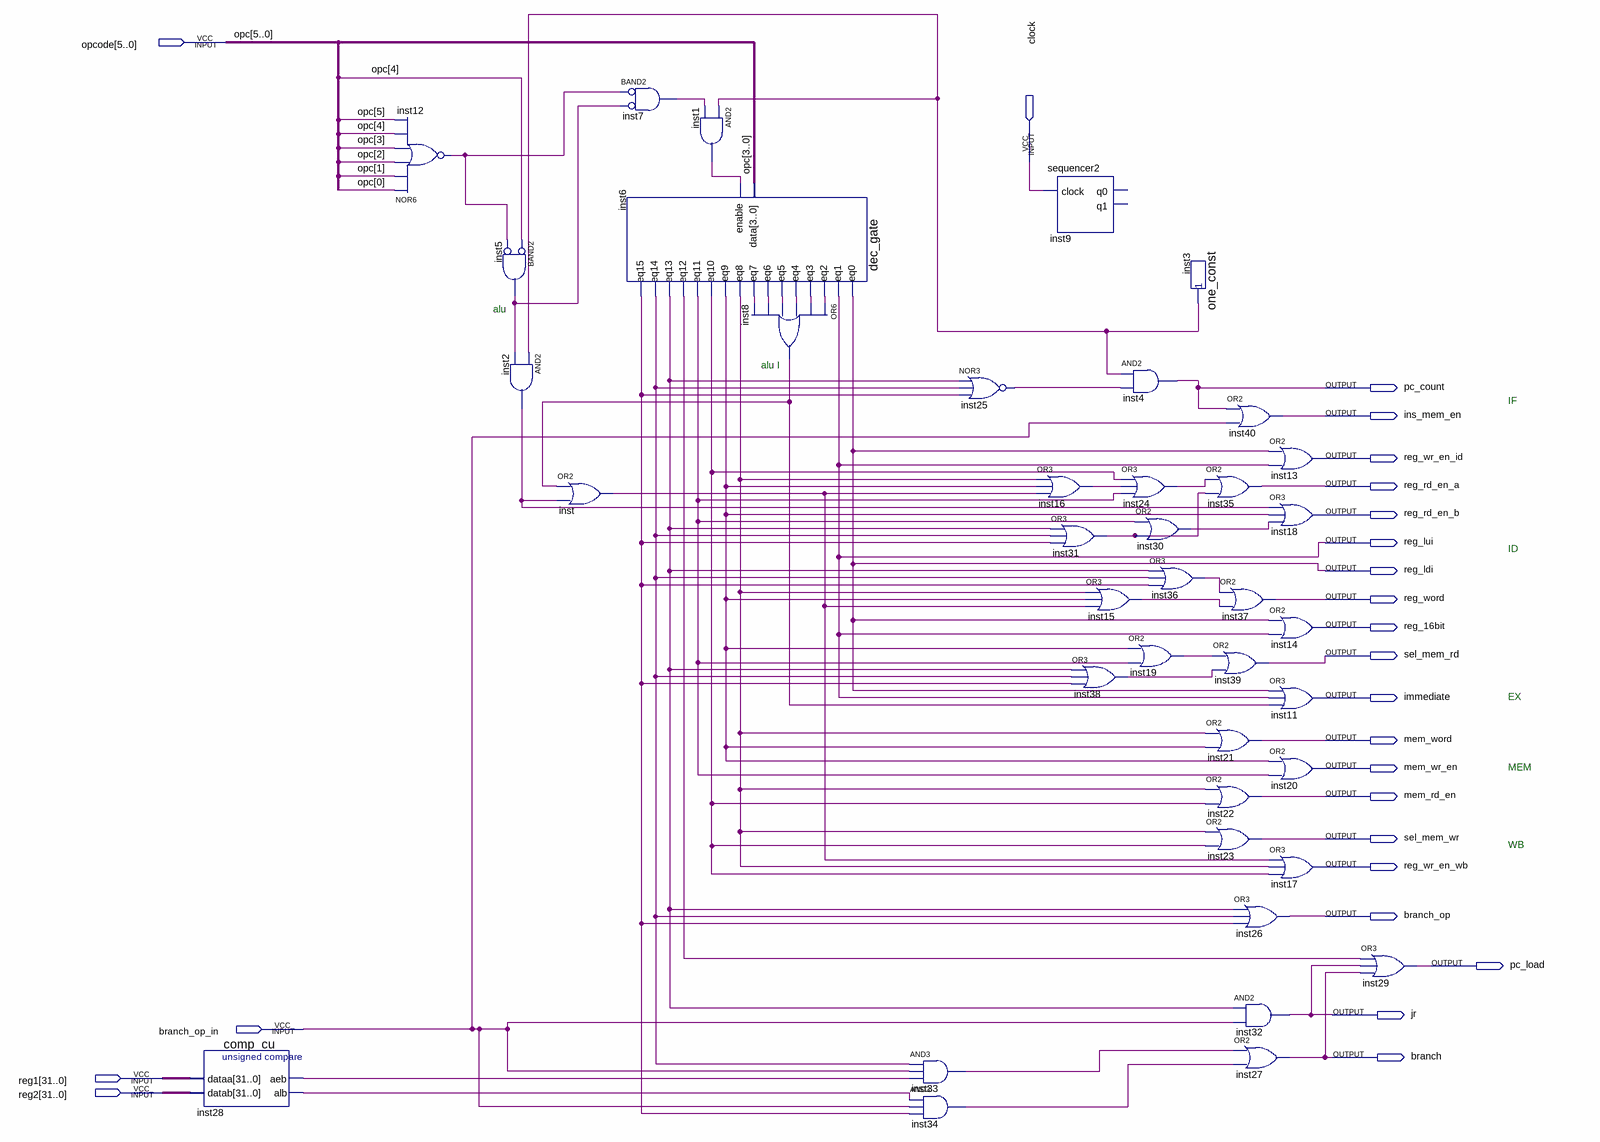
[diagram p0: schematic sheet]
// Quartus schematic CU_mp_pipline.bdf as structural Verilog: 40 symbols, 25 pins
module CU_mp_pipline (
  input  [5:0] opcode,
  input  clock,
  input  branch_op_in,
  input  [31:0] reg1,
  input  [31:0] reg2,
  output pc_count,
  output ins_mem_en,
  output reg_wr_en_id,
  output reg_rd_en_a,
  output reg_rd_en_b,
  output reg_lui,
  output reg_ldi,
  output reg_word,
  output reg_16bit,
  output sel_mem_rd,
  output immediate,
  output mem_word,
  output mem_wr_en,
  output mem_rd_en,
  output sel_mem_wr,
  output reg_wr_en_wb,
  output branch_op,
  output pc_load,
  output jr,
  output branch
);

  wire inst1_out, inst2_out, inst3_result, inst5_out, inst6_eq2, inst6_eq3, inst6_eq4, inst6_eq5, inst6_eq6,
       inst6_eq7, inst6_eq8, inst6_eq9, inst6_eq10, inst6_eq11, inst6_eq12, inst6_eq13, inst6_eq14,
       inst6_eq15, inst7_out, inst8_out, inst12_out, inst15_out, inst16_out, inst19_out, inst24_out,
       inst25_out, inst28_aeb, inst28_alb, inst30_out, inst31_out, inst33_out, inst34_out, inst36_out,
       inst38_out, inst_out;

  comp_cu inst28 (.dataa(reg1), .datab(reg2), .aeb(inst28_aeb), .alb(inst28_alb));
  nor inst12 (inst12_out, opcode[0], opcode[1], opcode[2], opcode[3], opcode[4], opcode[5]);
  and inst5 (inst5_out, ~opcode[4], ~inst12_out);  // BAND2
  and inst2 (inst2_out, inst3_result, inst5_out);
  or inst (inst_out, inst8_out, inst2_out);
  and inst7 (inst7_out, ~inst12_out, ~inst5_out);  // BAND2
  dec_gate inst6 (
    .data(opcode[3:0]), .enable(inst1_out), .eq0(reg_ldi), .eq1(reg_lui), .eq2(inst6_eq2), .eq3(inst6_eq3),
    .eq4(inst6_eq4), .eq5(inst6_eq5), .eq6(inst6_eq6), .eq7(inst6_eq7), .eq8(inst6_eq8), .eq9(inst6_eq9),
    .eq10(inst6_eq10), .eq11(inst6_eq11), .eq12(inst6_eq12), .eq13(inst6_eq13), .eq14(inst6_eq14),
    .eq15(inst6_eq15));
  and inst1 (inst1_out, inst3_result, inst7_out);
  or inst8 (inst8_out, inst6_eq2, inst6_eq3, inst6_eq4, inst6_eq5, inst6_eq6, inst6_eq7);
  and inst33 (inst33_out, inst6_eq14, branch_op_in, inst28_aeb);
  and inst34 (inst34_out, inst28_alb, branch_op_in, inst6_eq15);
  nor inst25 (inst25_out, inst6_eq13, inst6_eq14, inst6_eq15);
  sequencer2 inst9 (.clock(clock));  // open: q0, q1
  or inst16 (inst16_out, inst6_eq8, inst6_eq9, inst_out);
  or inst31 (inst31_out, inst6_eq13, inst6_eq14, inst6_eq15);
  or inst15 (inst15_out, inst6_eq8, inst6_eq9, inst_out);
  or inst38 (inst38_out, inst6_eq13, inst6_eq14, inst6_eq15);
  and inst4 (pc_count, inst3_result, inst25_out);
  or inst24 (inst24_out, inst6_eq10, inst16_out, inst6_eq11);
  or inst30 (inst30_out, inst6_eq11, inst31_out);
  or inst36 (inst36_out, inst6_eq13, inst6_eq14, inst6_eq15);
  or inst19 (inst19_out, inst6_eq9, inst6_eq11);
  one_const inst3 (.result(inst3_result));
  or inst35 (reg_rd_en_a, inst24_out, inst31_out);
  or inst39 (sel_mem_rd, inst19_out, inst38_out);
  or inst21 (mem_word, inst6_eq8, inst6_eq9);
  or inst22 (mem_rd_en, inst6_eq8, inst6_eq10);
  or inst23 (sel_mem_wr, inst6_eq8, inst6_eq10);
  or inst40 (ins_mem_en, pc_count, branch_op_in);
  or inst13 (reg_wr_en_id, reg_ldi, reg_lui);
  or inst18 (reg_rd_en_b, inst2_out, inst6_eq9, inst30_out);
  or inst37 (reg_word, inst36_out, inst15_out);
  or inst14 (reg_16bit, reg_ldi, reg_lui);
  or inst11 (immediate, reg_ldi, reg_lui, inst8_out);
  or inst20 (mem_wr_en, inst6_eq9, inst6_eq11);
  or inst17 (reg_wr_en_wb, inst_out, inst6_eq8, inst6_eq10);
  or inst26 (branch_op, inst6_eq13, inst6_eq14, inst6_eq15);
  and inst32 (jr, inst6_eq13, branch_op_in);
  or inst27 (branch, inst33_out, inst34_out);
  or inst29 (pc_load, inst6_eq12, jr, branch);

  // Other names for the same wires on the sheet: opc[5:0] = opcode

  // Notes on the sheet:
  //   alu
  //   alu I
  //   IF
  //   ID
  //   EX
  //   MEM
  //   WB
endmodule
